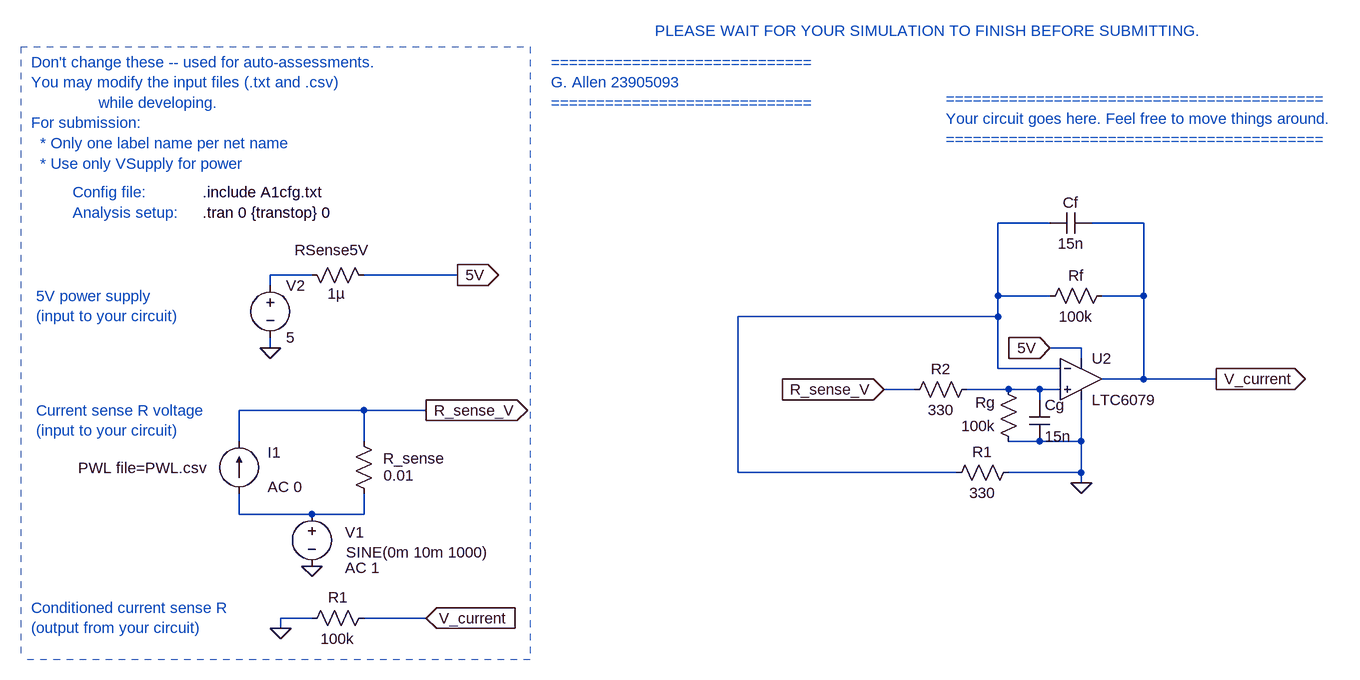
[diagram p0: schematic E344_Ass1_CurrSense.asc]
E344_Ass1_CurrSense.asc, the LTspice schematic file:
Version 4
SHEET 1 3140 2124
WIRE -784 -1152 -864 -1152
WIRE -640 -1152 -720 -1152
WIRE -1920 -1072 -1984 -1072
WIRE -1696 -1072 -1840 -1072
WIRE -1984 -1056 -1984 -1072
WIRE -864 -1040 -864 -1152
WIRE -784 -1040 -864 -1040
WIRE -640 -1040 -640 -1152
WIRE -640 -1040 -704 -1040
WIRE -864 -1008 -864 -1040
WIRE -864 -1008 -1264 -1008
WIRE -1984 -960 -1984 -976
WIRE -736 -960 -784 -960
WIRE -736 -944 -736 -960
WIRE -864 -928 -864 -1008
WIRE -768 -928 -864 -928
WIRE -640 -912 -640 -1040
WIRE -640 -912 -704 -912
WIRE -528 -912 -640 -912
WIRE -992 -896 -1040 -896
WIRE -848 -896 -912 -896
WIRE -800 -896 -848 -896
WIRE -768 -896 -800 -896
WIRE -800 -880 -800 -896
WIRE -1840 -864 -2032 -864
WIRE -1744 -864 -1840 -864
WIRE -2032 -816 -2032 -864
WIRE -1840 -816 -1840 -864
WIRE -800 -816 -848 -816
WIRE -736 -816 -736 -880
WIRE -736 -816 -800 -816
WIRE -1264 -768 -1264 -1008
WIRE -928 -768 -1264 -768
WIRE -736 -768 -736 -816
WIRE -736 -768 -848 -768
WIRE -736 -752 -736 -768
WIRE -2032 -704 -2032 -736
WIRE -1920 -704 -2032 -704
WIRE -1840 -704 -1840 -736
WIRE -1840 -704 -1920 -704
WIRE -1920 -544 -1968 -544
WIRE -1744 -544 -1840 -544
WIRE -1968 -528 -1968 -544
FLAG -1696 -1072 5V
IOPIN -1696 -1072 Out
FLAG -1984 -960 0
FLAG -784 -960 5V
IOPIN -784 -960 In
FLAG -1744 -864 R_sense_V
IOPIN -1744 -864 Out
FLAG -1920 -624 0
FLAG -528 -912 V_current
IOPIN -528 -912 Out
FLAG -1040 -896 R_sense_V
IOPIN -1040 -896 In
FLAG -1744 -544 V_current
IOPIN -1744 -544 In
FLAG -1968 -528 0
FLAG -736 -752 0
SYMBOL voltage -1984 -1072 R0
WINDOW 123 0 0 Left 0
WINDOW 39 0 0 Left 0
SYMATTR InstName V2
SYMATTR Value 5
SYMBOL res -1936 -1088 M90
WINDOW 0 -7 47 VBottom 2
WINDOW 3 29 54 VTop 2
SYMATTR InstName RSense5V
SYMATTR Value 1µ
SYMBOL res -1824 -720 R180
WINDOW 0 -109 70 Left 2
WINDOW 3 -62 44 Left 2
SYMATTR InstName R_sense
SYMATTR Value 0.01
SYMBOL current -2032 -736 R180
WINDOW 0 -64 63 Left 2
WINDOW 3 248 39 Right 2
WINDOW 123 -97 10 Left 2
WINDOW 39 0 0 Left 0
SYMATTR InstName I1
SYMATTR Value PWL file=PWL.csv
SYMATTR Value2 AC 0
SYMBOL voltage -1920 -720 R0
WINDOW 0 66 60 Bottom 2
WINDOW 3 163 59 Top 2
WINDOW 123 78 114 Bottom 2
WINDOW 39 0 0 Left 0
SYMATTR InstName V1
SYMATTR Value SINE(0m 10m 1000)
SYMATTR Value2 AC 1
SYMBOL res -1824 -560 R90
WINDOW 0 0 56 VBottom 2
WINDOW 3 32 56 VTop 2
SYMATTR InstName R1
SYMATTR Value 100k
SYMBOL OpAmps\\LTC6079 -736 -912 R0
SYMATTR InstName U2
SYMBOL res -896 -912 R90
WINDOW 0 0 56 VBottom 2
WINDOW 3 32 56 VTop 2
SYMATTR InstName R2
SYMATTR Value 330
SYMBOL res -832 -800 R180
WINDOW 0 36 76 Left 2
WINDOW 3 36 40 Left 2
SYMATTR InstName Rg
SYMATTR Value 100k
SYMBOL res -944 -752 R270
WINDOW 0 32 56 VTop 2
WINDOW 3 0 56 VBottom 2
SYMATTR InstName R1
SYMATTR Value 330
SYMBOL res -800 -1024 R270
WINDOW 0 32 56 VTop 2
WINDOW 3 0 56 VBottom 2
SYMATTR InstName Rf
SYMATTR Value 100k
SYMBOL cap -720 -1168 R90
WINDOW 0 0 32 VBottom 2
WINDOW 3 32 32 VTop 2
SYMATTR InstName Cf
SYMATTR Value 15n
SYMBOL cap -816 -880 R0
SYMATTR InstName Cg
SYMATTR Value 15n
TEXT -2088 -1168 Left 2 !.tran 0 {transtop} 0
TEXT -2088 -1200 Left 2 !.include A1cfg.txt
TEXT -2352 -1400 Left 2 ;Don't change these -- used for auto-assessments.\nYou may modify the input files (.txt and .csv) \n               while developing.\nFor submission: \n  * Only one label name per net name\n  * Use only VSupply for power
TEXT -2288 -1200 Left 2 ;Config file:
TEXT -2288 -1168 Left 2 ;Analysis setup:
TEXT -1552 -1400 Left 2 ;=============================\nG. Allen 23905093\n=============================
TEXT -944 -1344 Left 2 ;==========================================\nYour circuit goes here. Feel free to move things around. \n==========================================
TEXT -1392 -1448 Left 2 ;PLEASE WAIT FOR YOUR SIMULATION TO FINISH BEFORE SUBMITTING.
TEXT -2344 -1040 Left 2 ;5V power supply\n(input to your circuit)
TEXT -2344 -864 Left 2 ;Current sense R voltage\n(input to your circuit)
TEXT -2352 -560 Left 2 ;Conditioned current sense R\n(output from your circuit)
LINE Normal -1584 -1424 -1584 -480 2
LINE Normal -2368 -1424 -1584 -1424 2
LINE Normal -1584 -480 -2368 -480 2
LINE Normal -1584 -496 -1584 -496 2
LINE Normal -2368 -1424 -2368 -480 2

The netlist it stands for:
* E344_Ass1_CurrSense.asc
V2 N002 0 5
RSense5V N002 5V 1µ
R_sense N004 R_sense_V 0.01
I1 N004 R_sense_V PWL file=PWL.csv AC 0
V1 N004 0 SINE(0m 10m 1000) AC 1
R1 V_current 0 100k
XU2 N003 N001 5V 0 V_current LTC6078  ; LTC6079, pins In+ In- V+ V- OUT
R2 N003 R_sense_V 330
Rg 0 N003 100k
R1 N001 0 330
Rf N001 V_current 100k
Cf V_current N001 15n
Cg N003 0 15n
.tran 0 {transtop} 0
.include A1cfg.txt
* Don't change these -- used for auto-assessments.
* You may modify the input files (.txt and .csv)
*                while developing.
* For submission:
*   * Only one label name per net name
*   * Use only VSupply for power
* Config file:
* Analysis setup:
* =============================
* G. Allen 23905093
* =============================
* ==========================================
* Your circuit goes here. Feel free to move things around.
* ==========================================
* PLEASE WAIT FOR YOUR SIMULATION TO FINISH BEFORE SUBMITTING.
* 5V power supply
* (input to your circuit)
* Current sense R voltage
* (input to your circuit)
* Conditioned current sense R
* (output from your circuit)
.lib LTC5.lib
.backanno
.end